# Altium schematic sheet 19_DDR3_BOT.SchDoc: DDR3 bot
size A3; Organization: Lime Microsystems; Address1: Surrey Tech Centre; Address2: Guildford GU2 7YG; Address3: Surrey; Address4: United Kingdom; Revision: v1.2; SheetNumber: 17; SheetTotal: 27
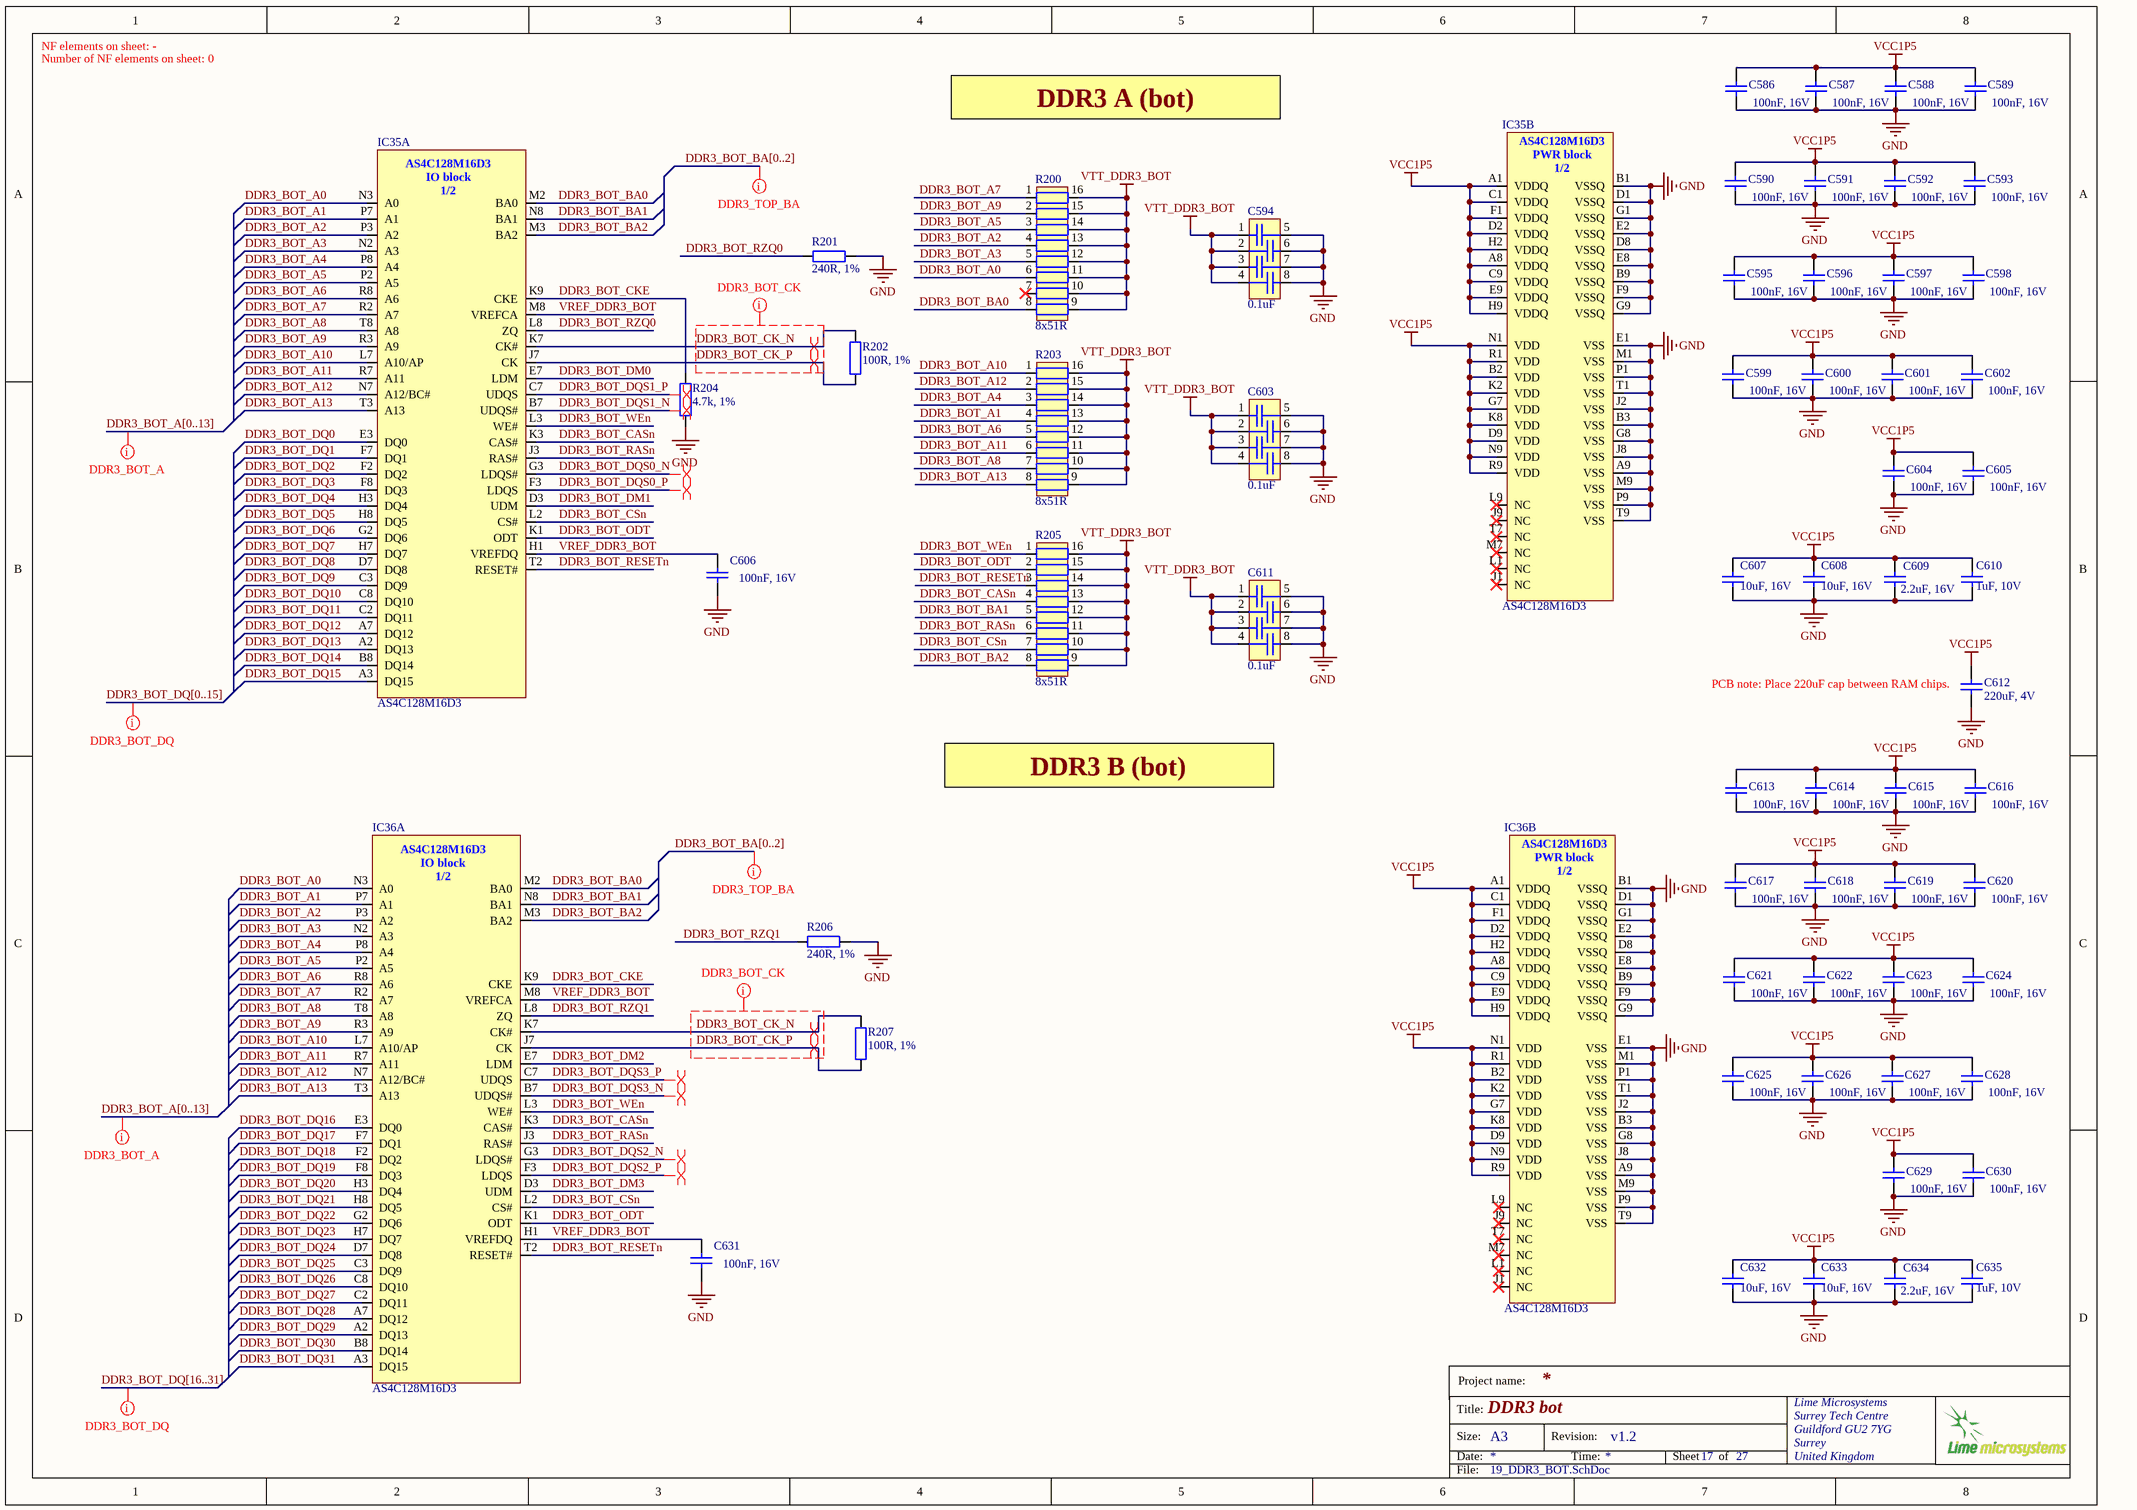
[diagram p0: 19_DDR3_BOT.SchDoc]

## Parts
C586  100nF, 16V  [CAP0402]
C587  100nF, 16V  [CAP0402]
C588  100nF, 16V  [CAP0402]
C589  100nF, 16V  [CAP0402]
C590  100nF, 16V  [CAP0402]
C591  100nF, 16V  [CAP0402]
C592  100nF, 16V  [CAP0402]
C593  100nF, 16V  [CAP0402]
C594  0.1uF  [CKCA43X7R1C104M100AA]
C595  100nF, 16V  [CAP0402]
C596  100nF, 16V  [CAP0402]
C597  100nF, 16V  [CAP0402]
C598  100nF, 16V  [CAP0402]
C599  100nF, 16V  [CAP0402]
C600  100nF, 16V  [CAP0402]
C601  100nF, 16V  [CAP0402]
C602  100nF, 16V  [CAP0402]
C603  0.1uF  [CKCA43X7R1C104M100AA]
C604  100nF, 16V  [CAP0402]
C605  100nF, 16V  [CAP0402]
C606  100nF, 16V  [CAP0402]
C607  10uF, 16V  [CAP0603]
C608  10uF, 16V  [CAP0603]
C609  2.2uF, 16V  [CAP0402]
C610  1uF, 10V  [CAP0402]
C611  0.1uF  [CKCA43X7R1C104M100AA]
C612  220uF, 4V  [CAP1206]
C613  100nF, 16V  [CAP0402]
C614  100nF, 16V  [CAP0402]
C615  100nF, 16V  [CAP0402]
C616  100nF, 16V  [CAP0402]
C617  100nF, 16V  [CAP0402]
C618  100nF, 16V  [CAP0402]
C619  100nF, 16V  [CAP0402]
C620  100nF, 16V  [CAP0402]
C621  100nF, 16V  [CAP0402]
C622  100nF, 16V  [CAP0402]
C623  100nF, 16V  [CAP0402]
C624  100nF, 16V  [CAP0402]
C625  100nF, 16V  [CAP0402]
C626  100nF, 16V  [CAP0402]
C627  100nF, 16V  [CAP0402]
C628  100nF, 16V  [CAP0402]
C629  100nF, 16V  [CAP0402]
C630  100nF, 16V  [CAP0402]
C631  100nF, 16V  [CAP0402]
C632  10uF, 16V  [CAP0603]
C633  10uF, 16V  [CAP0603]
C634  2.2uF, 16V  [CAP0402]
C635  1uF, 10V  [CAP0402]
IC35  AS4C128M16D3  [AS4C128M16D3]  (parts A,B of 2)
IC36  AS4C128M16D3  [AS4C128M16D3]  (parts A,B of 2)
R200  8x51R  [EXB2HV]
R201  240R, 1%  [RES0402]
R202  100R, 1%  [RES0402]
R203  8x51R  [EXB2HV]
R204  4.7k, 1%  [RES0402]
R205  8x51R  [EXB2HV]
R206  240R, 1%  [RES0402]
R207  100R, 1%  [RES0402]

## Nets
GND: C586.2 C587.2 C588.2 C589.2 C590.2 C591.2 C592.2 C593.2 C594.5 C594.6 C594.7 C594.8 C595.2 C596.2 C597.2 C598.2 C599.2 C600.2 C601.2 C602.2 C603.5 C603.6 C603.7 C603.8 C604.2 C605.2 C606.2 C607.1 C608.1 C609.2 C610.1 C611.5 C611.6 C611.7 C611.8 C612.1 C613.2 C614.2 C615.2 C616.2 C617.2 C618.2 C619.2 C620.2 C621.2 C622.2 C623.2 C624.2 C625.2 C626.2 C627.2 C628.2 C629.2 C630.2 C631.2 C632.1 C633.1 C634.2 C635.1 IC35.A9(VSS) IC35.B1(VSSQ) IC35.B3(VSS) IC35.B9(VSSQ) IC35.D1(VSSQ) IC35.D8(VSSQ) IC35.E1(VSS) IC35.E2(VSSQ) IC35.E8(VSSQ) IC35.F9(VSSQ) IC35.G1(VSSQ) IC35.G8(VSS) IC35.G9(VSSQ) IC35.J2(VSS) IC35.J8(VSS) IC35.M1(VSS) IC35.M9(VSS) IC35.P1(VSS) IC35.P9(VSS) IC35.T1(VSS) IC35.T9(VSS) IC36.A9(VSS) IC36.B1(VSSQ) IC36.B3(VSS) IC36.B9(VSSQ) IC36.D1(VSSQ) IC36.D8(VSSQ) IC36.E1(VSS) IC36.E2(VSSQ) IC36.E8(VSSQ) IC36.F9(VSSQ) IC36.G1(VSSQ) IC36.G8(VSS) IC36.G9(VSSQ) IC36.J2(VSS) IC36.J8(VSS) IC36.M1(VSS) IC36.M9(VSS) IC36.P1(VSS) IC36.P9(VSS) IC36.T1(VSS) IC36.T9(VSS) R201.2 R204.2 R206.2
VCC1P5: C586.1 C587.1 C588.1 C589.1 C590.1 C591.1 C592.1 C593.1 C595.1 C596.1 C597.1 C598.1 C599.1 C600.1 C601.1 C602.1 C604.1 C605.1 C607.2 C608.2 C609.1 C610.2 C612.2 C613.1 C614.1 C615.1 C616.1 C617.1 C618.1 C619.1 C620.1 C621.1 C622.1 C623.1 C624.1 C625.1 C626.1 C627.1 C628.1 C629.1 C630.1 C632.2 C633.2 C634.1 C635.2 IC35.A1(VDDQ) IC35.A8(VDDQ) IC35.B2(VDD) IC35.C1(VDDQ) IC35.C9(VDDQ) IC35.D2(VDDQ) IC35.D9(VDD) IC35.E9(VDDQ) IC35.F1(VDDQ) IC35.G7(VDD) IC35.H2(VDDQ) IC35.H9(VDDQ) IC35.K2(VDD) IC35.K8(VDD) IC35.N1(VDD) IC35.N9(VDD) IC35.R1(VDD) IC35.R9(VDD) IC36.A1(VDDQ) IC36.A8(VDDQ) IC36.B2(VDD) IC36.C1(VDDQ) IC36.C9(VDDQ) IC36.D2(VDDQ) IC36.D9(VDD) IC36.E9(VDDQ) IC36.F1(VDDQ) IC36.G7(VDD) IC36.H2(VDDQ) IC36.H9(VDDQ) IC36.K2(VDD) IC36.K8(VDD) IC36.N1(VDD) IC36.N9(VDD) IC36.R1(VDD) IC36.R9(VDD)
VTT_DDR3_BOT: C594.1 C594.2 C594.3 C594.4 C603.1 C603.2 C603.3 C603.4 C611.1 C611.2 C611.3 C611.4 R200.9 R200.10 R200.11 R200.12 R200.13 R200.14 R200.15 R200.16 R203.9 R203.10 R203.11 R203.12 R203.13 R203.14 R203.15 R203.16 R205.9 R205.10 R205.11 R205.12 R205.13 R205.14 R205.15 R205.16
DDR3_BOT_A0: IC35.N3(A0) IC36.N3(A0) R200.6
DDR3_BOT_A1: IC35.P7(A1) IC36.P7(A1) R203.4
DDR3_BOT_A2: IC35.P3(A2) IC36.P3(A2) R200.4
DDR3_BOT_A3: IC35.N2(A3) IC36.N2(A3) R200.5
DDR3_BOT_A4: IC35.P8(A4) IC36.P8(A4) R203.3
DDR3_BOT_A5: IC35.P2(A5) IC36.P2(A5) R200.3
DDR3_BOT_A6: IC35.R8(A6) IC36.R8(A6) R203.5
DDR3_BOT_A7: IC35.R2(A7) IC36.R2(A7) R200.1
DDR3_BOT_A8: IC35.T8(A8) IC36.T8(A8) R203.7
DDR3_BOT_A9: IC35.R3(A9) IC36.R3(A9) R200.2
DDR3_BOT_A10: IC35.L7(A10/AP) IC36.L7(A10/AP) R203.1
DDR3_BOT_A11: IC35.R7(A11) IC36.R7(A11) R203.6
DDR3_BOT_A12: IC35.N7(A12/BC#) IC36.N7(A12/BC#) R203.2
DDR3_BOT_A13: IC35.T3(A13) IC36.T3(A13) R203.8
DDR3_BOT_BA0: IC35.M2(BA0) IC36.M2(BA0) R200.8
DDR3_BOT_BA1: IC35.N8(BA1) IC36.N8(BA1) R205.5
DDR3_BOT_BA2: IC35.M3(BA2) IC36.M3(BA2) R205.8
DDR3_BOT_CASn: IC35.K3(CAS#) IC36.K3(CAS#) R205.4
DDR3_BOT_CK_N: IC35.K7(CK#) IC36.K7(CK#) R202.2 R207.2
DDR3_BOT_CK_P: IC35.J7(CK) IC36.J7(CK) R202.1 R207.1
DDR3_BOT_CKE: IC35.K9(CKE) IC36.K9(CKE) R204.1
DDR3_BOT_CSn: IC35.L2(CS#) IC36.L2(CS#) R205.7
DDR3_BOT_DM0: IC35.E7(LDM)
DDR3_BOT_DM1: IC35.D3(UDM)
DDR3_BOT_DM2: IC36.E7(LDM)
DDR3_BOT_DM3: IC36.D3(UDM)
DDR3_BOT_DQ0: IC35.E3(DQ0)
DDR3_BOT_DQ1: IC35.F7(DQ1)
DDR3_BOT_DQ2: IC35.F2(DQ2)
DDR3_BOT_DQ3: IC35.F8(DQ3)
DDR3_BOT_DQ4: IC35.H3(DQ4)
DDR3_BOT_DQ5: IC35.H8(DQ5)
DDR3_BOT_DQ6: IC35.G2(DQ6)
DDR3_BOT_DQ7: IC35.H7(DQ7)
DDR3_BOT_DQ8: IC35.D7(DQ8)
DDR3_BOT_DQ9: IC35.C3(DQ9)
DDR3_BOT_DQ10: IC35.C8(DQ10)
DDR3_BOT_DQ11: IC35.C2(DQ11)
DDR3_BOT_DQ12: IC35.A7(DQ12)
DDR3_BOT_DQ13: IC35.A2(DQ13)
DDR3_BOT_DQ14: IC35.B8(DQ14)
DDR3_BOT_DQ15: IC35.A3(DQ15)
DDR3_BOT_DQ16: IC36.E3(DQ0)
DDR3_BOT_DQ17: IC36.F7(DQ1)
DDR3_BOT_DQ18: IC36.F2(DQ2)
DDR3_BOT_DQ19: IC36.F8(DQ3)
DDR3_BOT_DQ20: IC36.H3(DQ4)
DDR3_BOT_DQ21: IC36.H8(DQ5)
DDR3_BOT_DQ22: IC36.G2(DQ6)
DDR3_BOT_DQ23: IC36.H7(DQ7)
DDR3_BOT_DQ24: IC36.D7(DQ8)
DDR3_BOT_DQ25: IC36.C3(DQ9)
DDR3_BOT_DQ26: IC36.C8(DQ10)
DDR3_BOT_DQ27: IC36.C2(DQ11)
DDR3_BOT_DQ28: IC36.A7(DQ12)
DDR3_BOT_DQ29: IC36.A2(DQ13)
DDR3_BOT_DQ30: IC36.B8(DQ14)
DDR3_BOT_DQ31: IC36.A3(DQ15)
DDR3_BOT_DQS0_N: IC35.G3(LDQS#)
DDR3_BOT_DQS0_P: IC35.F3(LDQS)
DDR3_BOT_DQS1_N: IC35.B7(UDQS#)
DDR3_BOT_DQS1_P: IC35.C7(UDQS)
DDR3_BOT_DQS2_N: IC36.G3(LDQS#)
DDR3_BOT_DQS2_P: IC36.F3(LDQS)
DDR3_BOT_DQS3_N: IC36.B7(UDQS#)
DDR3_BOT_DQS3_P: IC36.C7(UDQS)
DDR3_BOT_ODT: IC35.K1(ODT) IC36.K1(ODT) R205.2
DDR3_BOT_RASn: IC35.J3(RAS#) IC36.J3(RAS#) R205.6
DDR3_BOT_RESETn: IC35.T2(RESET#) IC36.T2(RESET#) R205.3
DDR3_BOT_RZQ0: IC35.L8(ZQ) R201.1
DDR3_BOT_RZQ1: IC36.L8(ZQ) R206.1
DDR3_BOT_WEn: IC35.L3(WE#) IC36.L3(WE#) R205.1
VREF_DDR3_BOT: C606.1 C631.1 IC35.H1(VREFDQ) IC35.M8(VREFCA) IC36.H1(VREFDQ) IC36.M8(VREFCA)

Not connected (* = marked no-connect by the designer): IC35 J1(NC)* J9(NC)* L1(NC)* L9(NC)* M7(NC)* T7(NC)*; IC36 J1(NC)* J9(NC)* L1(NC)* L9(NC)* M7(NC)* T7(NC)*; R200 7*

## Buses and harness runs
bus DDR3_BOT_A[0..13]
bus DDR3_BOT_BA[0..2]
bus DDR3_BOT_DQ[0..15]
bus DDR3_BOT_DQ[16..31]

## Layout directives
net class DDR3_BOT_DQ: (no net found under the mark)
net class DDR3_TOP_BA: (no net found under the mark)
net class DDR3_BOT_A: (no net found under the mark)
differential pair: DDR3_BOT_CK_N, DDR3_BOT_CK_P, DDR3_BOT_DQS0_N, DDR3_BOT_DQS0_P, DDR3_BOT_DQS1_N, DDR3_BOT_DQS1_P, DDR3_BOT_DQS2_N, DDR3_BOT_DQS2_P, DDR3_BOT_DQS3_N, DDR3_BOT_DQS3_P
net class DDR3_BOT_CK: (no net found under the mark), DDR3_BOT_CK_N, DDR3_BOT_CK_P

## Notes on the sheet
- NF elements on sheet: -
- Number of NF elements on sheet: 0
- DDR3 A (bot)
- (near C612) PCB note: Place 220uF cap between RAM chips.
- DDR3 B (bot)
- Project name:
- Title:
- Size:
- Date:
- A3
- Revision:
- Time:
- Sheet
- of
- File:
- (in symbol AS4C128M16D3, part A) AS4C128M16D3 / IO block / 1/2
- (in symbol AS4C128M16D3, part B) AS4C128M16D3 / PWR block / 1/2

## Library data of the parts
C586-C593 C595-C602 C604-C606 C613-C631 = Cap_0603: Part Description: 0.10µF ±10% 16V Ceramic Capacitor X7R 0402 (1005 Metric); Manufacturer Part Number 1: GRM155R71C104KA88D; Brand: Murata Electronics; Tolerance: 10 %; Type: General Purpose MLCC; Capacitance: 0.1 uF; Temperature Coefficient / Code: +/- 15 %; Case Height: 0.5 mm; Case Length: 1 mm; Dielectric: X7R; Supplier 1: Mouser; Supplier Part Number 1: 81-GRM155R71C104KA88; Case Code - in: 0402; Manufacturer: Murata Electronics; Category: Multilayer Ceramic Capacitors MLCC - SMD/SMT; Voltage Rating DC: 16 V; Value: 100nF, 16V; Case Code - mm: 1005; Case Width: 0.5 mm; Manufacturer Part Number: GRM155R71C104KA88D; Maximum Operating Temperature: + 125 C; Minimum Operating Temperature: - 55 C; Minimum Order Quantity: 1; Operating Temperature Range: - 55 C to + 125 C; Package / Case: 0402 (1005 metric); Packaging: Reel; Product: General Type MLCCs; Product Category: Low & Medium Capacitance SMD Ceramic Chip Capacitors; Reeling: True; RoHS - Mouser: Y; RoHS: RoHS Compliant; Series: GRM; Standard Pack Qty: 10000; Termination Style: SMD/SMT
C594 C603 C611 = 4X_cap_array_1206: Manufacturer: TDK; Part Description: 0.10µF ±20% Isolated Capacitor 4 Array 16V X7R 1206 (3216 Metric); Case Height: 1 mm; Case Length: 3.2 mm; Case Width: 1.6 mm; Voltage Rating: 16 V; Number of Elements: 4; Tolerance: 20 %; Temperature Coefficient / Code: X7R; Value: 0.1uF; Supplier 1: Mouser; Supplier Part Number 1: 810-CKCA43X7R1C104M; RoHS: RoHS Compliant; Termination Style: SMD/SMT; Brand: TDK; Category: Capacitor Arrays & Networks; Product: Ceramic Capacitor Arrays; Series: CKC; Packaging: Reel; Operating Temperature Range: - 55 C to + 125 C; Manufacturer Part Number 1: CKCA43X7R1C104M100AA; Capacitance: 0.1 uF; Product Category: Capacitor Arrays; Standard Pack Qty: 2000; RoHS - Mouser: Y; Minimum Order Quantity: 1; Reeling: True
C607 C608 C632 C633 = Cap_0603: Manufacturer Part Number 1: GRM188R61C106MA73D; Manufacturer: Yageo; Part Description: 10µF ±20% 16V Ceramic Capacitor X5R 0603 (1608 Metric); Capacitance: 10µF; Tolerance: ±20%; Temperature Coefficient: X5R; Supplier 1: Digi-Key; Supplier Part Number 1: 490-7201-2-ND; Package / Case: 0603 (1608 Metric); Category: Capacitors; Voltage - Rated: 16V; Value: 10uF, 16V; Applications: General Purpose; Features: -; Height - Seated (Max): -; Lead Spacing: -; Lead Style: -; Mounting Type: Surface Mount, MLCC; Operating Temperature: -55°C ~ 85°C; Packaging: Tape & Reel (TR); Ratings: -; RoHS: RoHS Compliant; Size / Dimension: 0.063" L x 0.031" W (1.60mm x 0.80mm); Thickness (Max): 0.039" (1.00mm)
C609 C634 = Cap_0603: CAP CER 2.2UF 16V 10% X5R 0402; Manufacturer Part Number 1: C1005X5R1C225K050BC; Part Description: 2.2µF ±10% 16V Ceramic Capacitor X5R 0402 (1005 Metric); Manufacturer: TDK Corporation; Capacitance: 2.2µF; Capacitor Case Style: 0402 [1005 Metric]; Value: 2.2uF, 16V; Supplier 1: Digi-Key; Supplier Part Number 1: 445-9085-6-ND; Tolerance: ±10%; Operating Temperature: -55°C ~ 85°C; Voltage - Rated: 16V; Category: Capacitors; Package / Case: 0402 (1005 Metric); Operating Temperature Range: -55°C to +85; Applications: General Purpose; Features: -; Height - Seated (Max): -; Lead Spacing: -; Lead Style: -; Mounting Type: Surface Mount, MLCC; Packaging: Tape & Reel (TR); Ratings: -; RoHS: RoHS Compliant; Size / Dimension: 0.039" L x 0.020" W (1.00mm x 0.50mm); Temperature Coefficient: X5R; Thickness (Max): 0.022" (0.55mm)
C610 C635 = Cap_0603: Manufacturer: TDK; Manufacturer Part Number 1: GRM155R61A105KE15J; Part Description: 1µF ±10% 10V Ceramic Capacitor X5R 0402 (1005 Metric); Capacitance: 1; Capacitance Tolerance: ± 10%; Ceramic Capacitor Case: 0402 [1005 Metric]; Dielectric Characteristic: X6; Product Range: TDK - C Series; Voltage Rating: 10; Supplier 1: Newark; Supplier Part Number 1: 490-6298-2-ND; Value: 1uF, 10V; MSL: -; RoHS: YES
C612 = Cap_1206: Manufacturer Part Number: GRM31CR60G227ME11L; Manufacturer: Murata Electronics North America; Part Description: 220µF ±20% 4V Ceramic Capacitor X5R 1206 (3216 Metric); Capacitance: 220µF; Temperature Coefficient: X5R; Tolerance: ±20%; Package / Case: 1206 (3216 Metric); Supplier 1: Digi-Key; Packaging: Cut Tape (CT); Size / Dimension: 0.126" L x 0.063" W (3.20mm x 1.60mm); Operating Temperature: -55°C ~ 85°C; Voltage - Rated: 4V; Mounting Type: Surface Mount, MLCC; Ratings: -; Supplier Part Number 1: 490-9774-1-ND; Category: Capacitors; Lead Spacing: -; Lead Style: -; Applications: General Purpose; Features: -; Height - Seated (Max): -; Thickness (Max): 0.075" (1.90mm); RoHS: RoHS Compliant; Value: 220uF, 4V; Manufacturer Part Number 1: GRM31CR60G227ME11L
IC35 IC36 = AS4C128M16D3: Manufacturer: Alliance Memory, Inc.; Manufacturer Part Number 1: AS4C128M16D3-12BCN; Part Description: IC SDRAM DDR3 128M X 16 96-FBGA; Memory Size: 2G (128M x 16); Interface: Parallel; Voltage - Supply: 1.425 V ~ 1.575 V; Format - Memory: RAM; Supplier 1: Digi-Key; Supplier Part Number 1: 1450-1083-ND; Supplier Device Package: 96-FBGA (13x9); Package / Case: 96-TFBGA; Supplier: Digi-Key; Category: Integrated Circuits (ICs)
R200 R203 R205 = 8X_resistor_array_0402: Manufacturer: PANASONIC ELECTRONIC COMPONENTS; Manufacturer Part Number 1: EXB2HV510JV; Part Description: RES ARRAY 8 RES 51 OHM 1506; Supplier 1: Farnell; Supplier Part Number 1: 2060069RL; Manufacturer: Panasonic Electronic Components
R201 R206 = Res_0402: Part Description: RES SMD 240 OHM 1% 1/16W 0402; Manufacturer Part Number 1: CRCW0402240RFKED; Manufacturer: Vishay Dale; Power (Watts): 0.063W, 1/16W; Temperature Coefficient: ±100ppm/°C; Resistance (Ohms): 240; Supplier 1: Digi-Key; Supplier Part Number 1: 541-240LDKR-ND; Tolerance: ±1%; Supplier Device Package: 0402 (1005 Metric); Category: Resistors; Value: 240R, 1%
R202 R207 = Res_0402: Manufacturer Part Number 1: RMCF0402FT100R; Part Description: RES SMD 100 OHM 1% 1/16W 0402; Manufacturer: Stackpole Electronics Inc.; Temperature Coefficient: ±100ppm/°C; Supplier 1: Digi-Key; Supplier Part Number 1: RMCF0402FT100RDKR-ND; Package / Case: 0402 (1005 Metric); Composition: Thick Film; Category: Resistors; Tolerance: ±1%; Value: 100R, 1%
R204 = Res_0402: Manufacturer: Yageo; Part Description: RES SMD 4.7K OHM 1% 1/16W 0402; Manufacturer Part Number1: RC0402FR-074K7L; Temperature Coefficient: ±100ppm/°C; Power (Watts): 0.063W, 1/16W; Number of Terminations: 2; Category: Resistors; Supplier 1: Digi-Key; Height: 0.016" (0.40mm); Features: Moisture Resistant; Size / Dimension: 0.039" L x 0.020" W (1.00mm x 0.50mm); Supplier Device Package: 0402; RoHS: RoHS Compliant; Composition: Thick Film; Package / Case: 0402 (1005 Metric); Resistance (Ohms): 4.7k; Operating Temperature: -55°C ~ 155°C; Tolerance: ±1%; Supplier Part Number 1: 311-4.7KLRCT-ND; Packaging: Cut Tape (CT); Value: 4.7k, 1%